# EAGLE schematic nano2 (EAGLE 7.1.0)
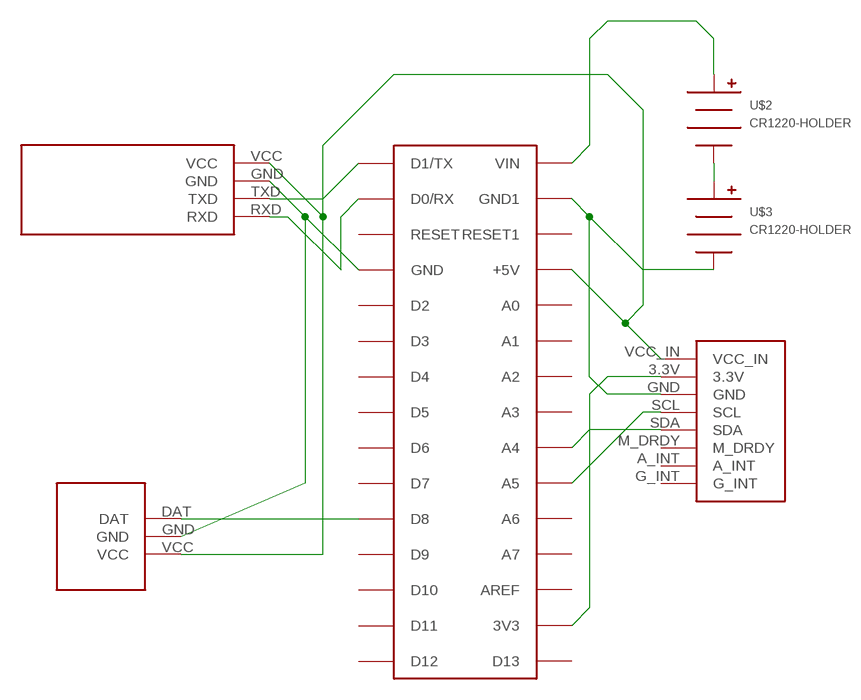
[diagram p0: schematic, sheet 1]

## Parts
U$1  ARDUINONANO  [PDIP-32]
U$2  CR1220-HOLDER  [HARWIN-CR1220]
U$3  CR1220-HOLDER  [HARWIN-CR1220]
U$4  GY85  [GY85]
U$5  HC06  [HC06]
U$6  KEY_SMALL  [KEY_SMALL]

## Nets
N$1: U$1.+5V U$4.VCC_IN U$5.VCC U$6.VCC
N$2: U$1.VIN U$2.POS
N$3: U$1.GND1 U$3.NEG U$4.GND
N$4: U$1.3V3 U$4.3.3V
N$5: U$1.GND U$5.GND U$6.GND
N$6: U$1.D8 U$6.DAT
N$7: U$2.NEG U$3.POS
N$8: U$1.D1/TX U$5.TXD
N$9: U$1.D0/RX U$5.RXD
N$11: U$1.A5 U$4.SCL
N$12: U$1.A4 U$4.SDA
Unconnected: U$1.A0 U$1.A1 U$1.A2 U$1.A3 U$1.A6 U$1.A7 U$1.AREF U$1.D2 U$1.D3 U$1.D4 U$1.D5 U$1.D6 U$1.D7 U$1.D9 U$1.D10 U$1.D11 U$1.D12 U$1.D13 U$1.RESET U$1.RESET1 U$4.A_INT U$4.G_INT U$4.M_DRDY

## Library data of the parts
U$1 = jet-lib:ARDUINONANO
U$2 U$3 = battery-holder:CR1220-HOLDER
U$4 = RMQLIFE:GY85: gy85, accelerator, gyrometer, magmeter
U$5 = RMQLIFE:HC06: bluetooth slave
U$6 = RMQLIFE:KEY_SMALL: Small key